# EAGLE design MainBoard (EAGLE 7.7.0)
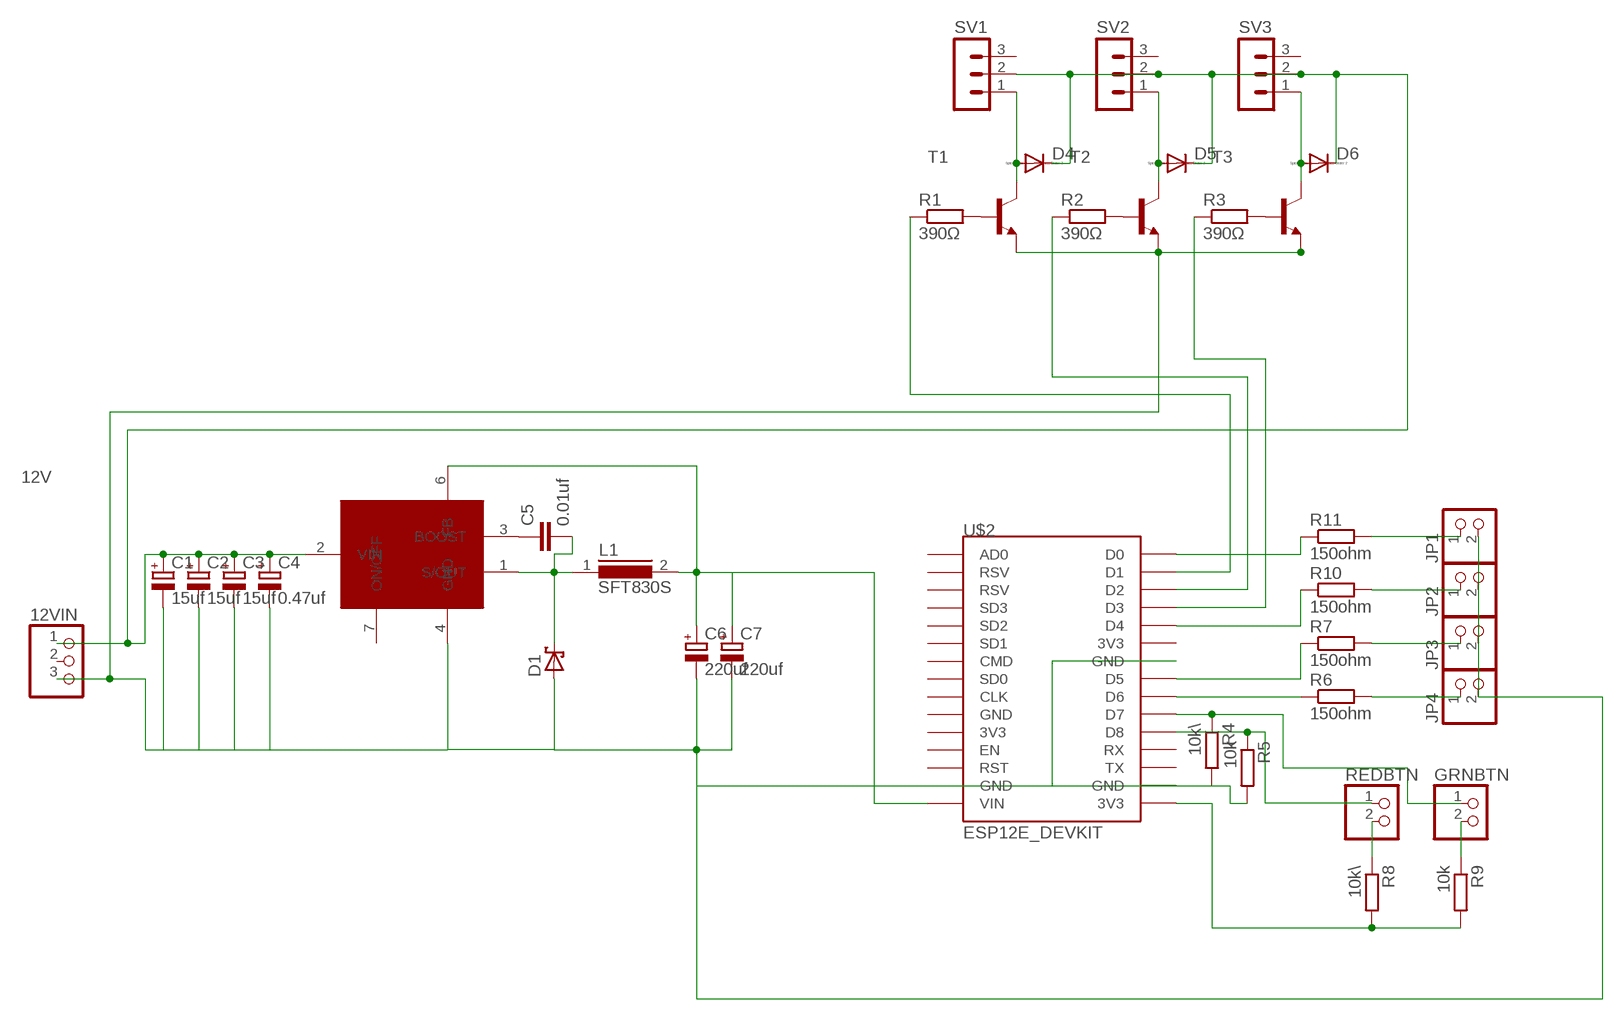
[diagram p0: schematic, sheet 1]

## Parts
12VIN  PINHD-1X3  [1X03]
C1  15uf  CPOL-EUE2,5-6E  [E2,5-6E]
C2  15uf  CPOL-EUE2,5-6E  [E2,5-6E]
C3  15uf  CPOL-EUE2,5-6E  [E2,5-6E]
C4  0.47uf  CPOL-EUE2,5-6E  [E2,5-6E]
C5  0.01uf  C-EU050-024X044  [C050-024X044]
C6  220uf  CPOL-EUE2,5-6E  [E2,5-6E]
C7  220uf  CPOL-EUE2,5-6E  [E2,5-6E]
D1  SCHOTTKY-DIODEC4111-15  [C4111-15]
D4  DIODE-D-2.5  [D-2.5]
D5  DIODE-D-2.5  [D-2.5]
D6  DIODE-D-2.5  [D-2.5]
GRNBTN  PINHD-1X2  [1X02]
JP1  PINHD-1X2  [1X02]
JP2  PINHD-1X2  [1X02]
JP3  PINHD-1X2  [1X02]
JP4  PINHD-1X2  [1X02]
L1  SFT830S  [SFT830S]
R1  390Ω  R-EU_0207/5V  [0207/5V]
R2  390Ω  R-EU_0207/5V  [0207/5V]
R3  390Ω  R-EU_0207/5V  [0207/5V]
R4  10k\  R-EU_0207/5V  [0207/5V]
R5  10k  R-EU_0207/5V  [0207/5V]
R6  150ohm  R-EU_0204/2V  [0204V]
R7  150ohm  R-EU_0204/2V  [0204V]
R8  10k\  R-EU_0207/5V  [0207/5V]
R9  10k  R-EU_0207/5V  [0207/5V]
R10  150ohm  R-EU_0204/2V  [0204V]
R11  150ohm  R-EU_0204/2V  [0204V]
REDBTN  PINHD-1X2  [1X02]
SV1  MA03-1  [MA03-1]
SV2  MA03-1  [MA03-1]
SV3  MA03-1  [MA03-1]
T1  -NPN-TO92  [TO92]
T2  -NPN-TO92  [TO92]
T3  -NPN-TO92  [TO92]
U$1  LM2678T-5  [TO-220]
U$2  ESP12E_DEVKIT  [ESP12E_DEVKIT]

## Nets
5V: C6.+ C7.+ L1.2 U$1.6(FB) U$2.VIN
12V: 12VIN.1 C1.+ C2.+ C3.+ C4.+ D4.C D5.C D6.C SV1.2 SV2.2 SV3.2 U$1.2(VIN)
GND: 12VIN.3 C1.- C2.- C3.- C4.- C6.- C7.- D1.A JP1.2 JP2.2 JP3.2 JP4.2 R4.2 R5.2 T1.1(E) T2.1(E) T3.1(E) U$1.4(GND) U$2.GND@1(GND) U$2.GND@2(GND) U$2.GND@3(GND)
N$1: R1.1 U$2.D1
N$2: R2.1 U$2.D2
N$3: D4.A SV1.1 T1.3(C)
N$4: C5.2 D1.C L1.1 U$1.1(S/OUT)
N$5: D5.A SV2.1 T2.3(C)
N$6: C5.1 U$1.3(BOOST)
N$7: D6.A SV3.1 T3.3(C)
N$8: R3.1 U$2.D3
N$9: R1.2 T1.2(B)
N$10: R2.2 T2.2(B)
N$11: R3.2 T3.2(B)
N$12: R8.2 R9.2 U$2.3V3@2(3V3)
N$13: R8.1 REDBTN.2
N$15: R11.1 U$2.D0
N$16: R10.1 U$2.D4
N$17: R7.1 U$2.D5
N$18: R6.1 U$2.D6
N$19: JP1.1 R11.2
N$20: JP2.1 R10.2
N$21: JP3.1 R7.2
N$22: GRNBTN.2 R9.1
N$23: R5.1 REDBTN.1 U$2.D8
N$24: GRNBTN.1 R4.1 U$2.D7
N$25: JP4.1 R6.2
Unconnected: 12VIN.2 SV1.3 SV2.3 SV3.3 U$1.7(ON/OFF) U$2.3V3@0(3V3) U$2.3V3@1(3V3) U$2.AD0 U$2.CLK U$2.CMD U$2.EN U$2.GND@0(GND) U$2.RST U$2.RSV@0(RSV) U$2.RSV@1(RSV) U$2.RX U$2.SD0 U$2.SD1 U$2.SD2 U$2.SD3 U$2.TX

## Library data of the parts
12VIN = pinhead:PINHD-1X3: PIN HEADER
C1-C4 C6 C7 = rcl:CPOL-EU: POLARIZED CAPACITOR, European symbol
C5 = rcl:C-EU: CAPACITOR, European symbol
D1 = diode:SCHOTTKY-DIODE: Schottky Diode
D4-D6 = diode:DIODE-: DIODE
GRNBTN JP1-JP4 REDBTN = pinhead:PINHD-1X2: PIN HEADER
L1 = inductors:SFT830S: INDUCTOR
R1-R5 R8 R9 = resistor:R-EU_: RESISTOR, European symbol
R6 R7 R10 R11 = rcl:R-EU_: RESISTOR, European symbol
SV1-SV3 = con-lstb:MA03-1: PIN HEADER; OC_FARNELL: unknown; OC_NEWARK: unknown
T1-T3 = transistor:*-NPN-: NPN Transistror BF959 corrected 2008.03.06
U$1 = FanThingParts:LM2678T-5
U$2 = ESP12E_DEVKIT:ESP12E_DEVKIT: ESP12E DEVKIT BOARD

## Board
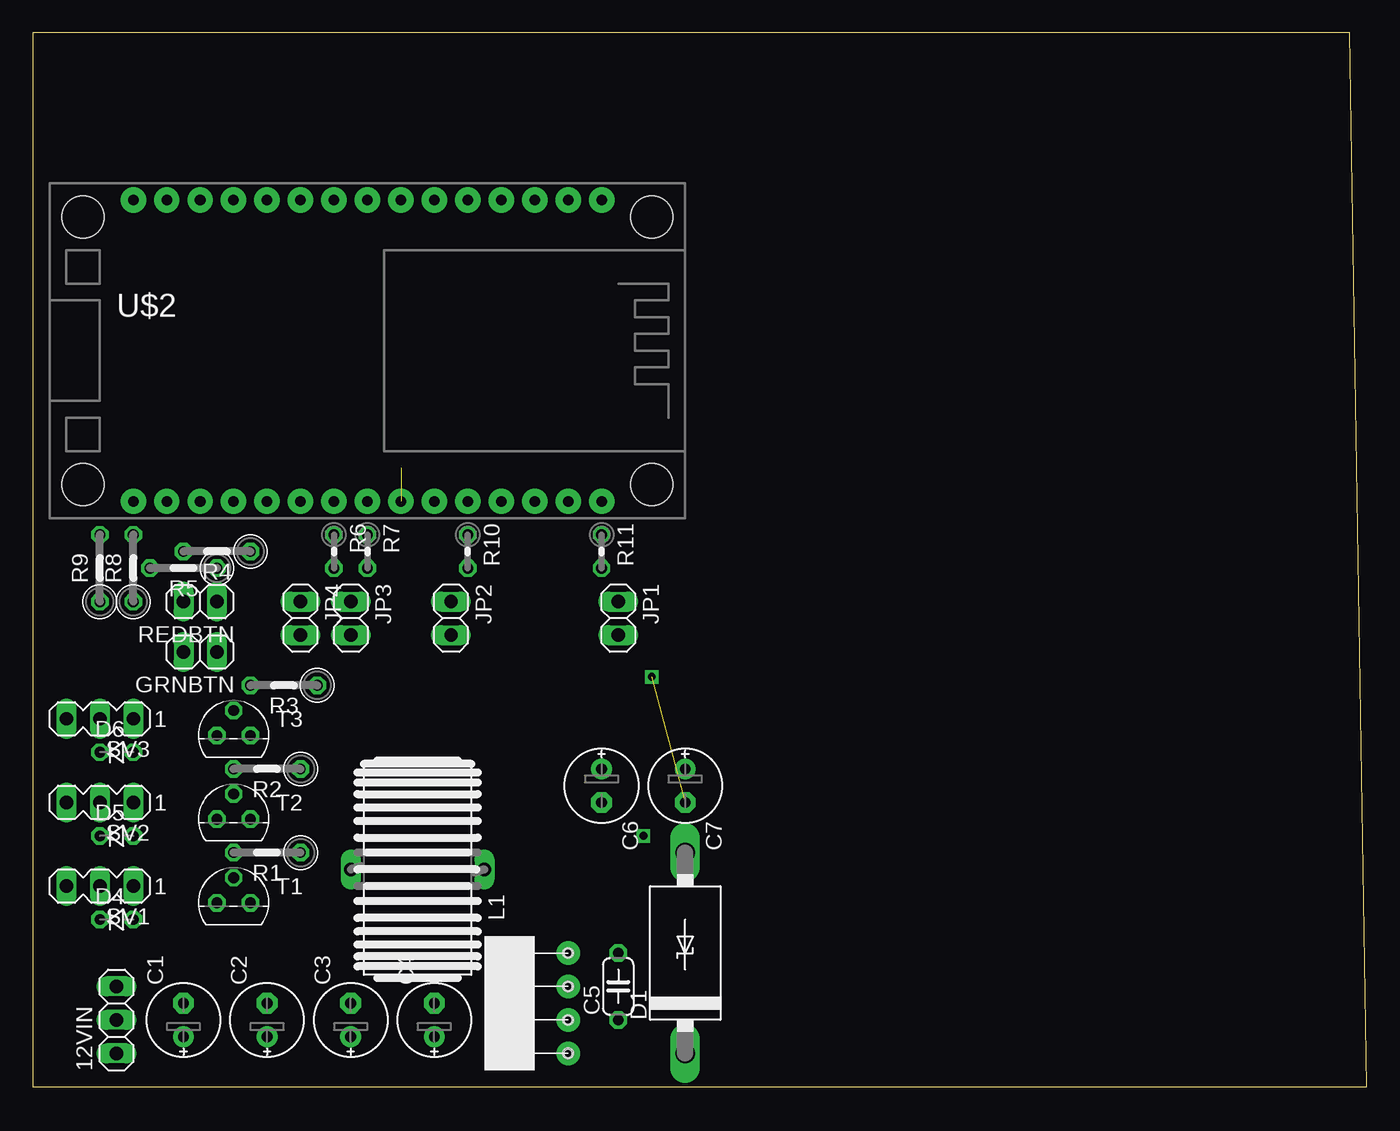
[diagram p1: board, top side]
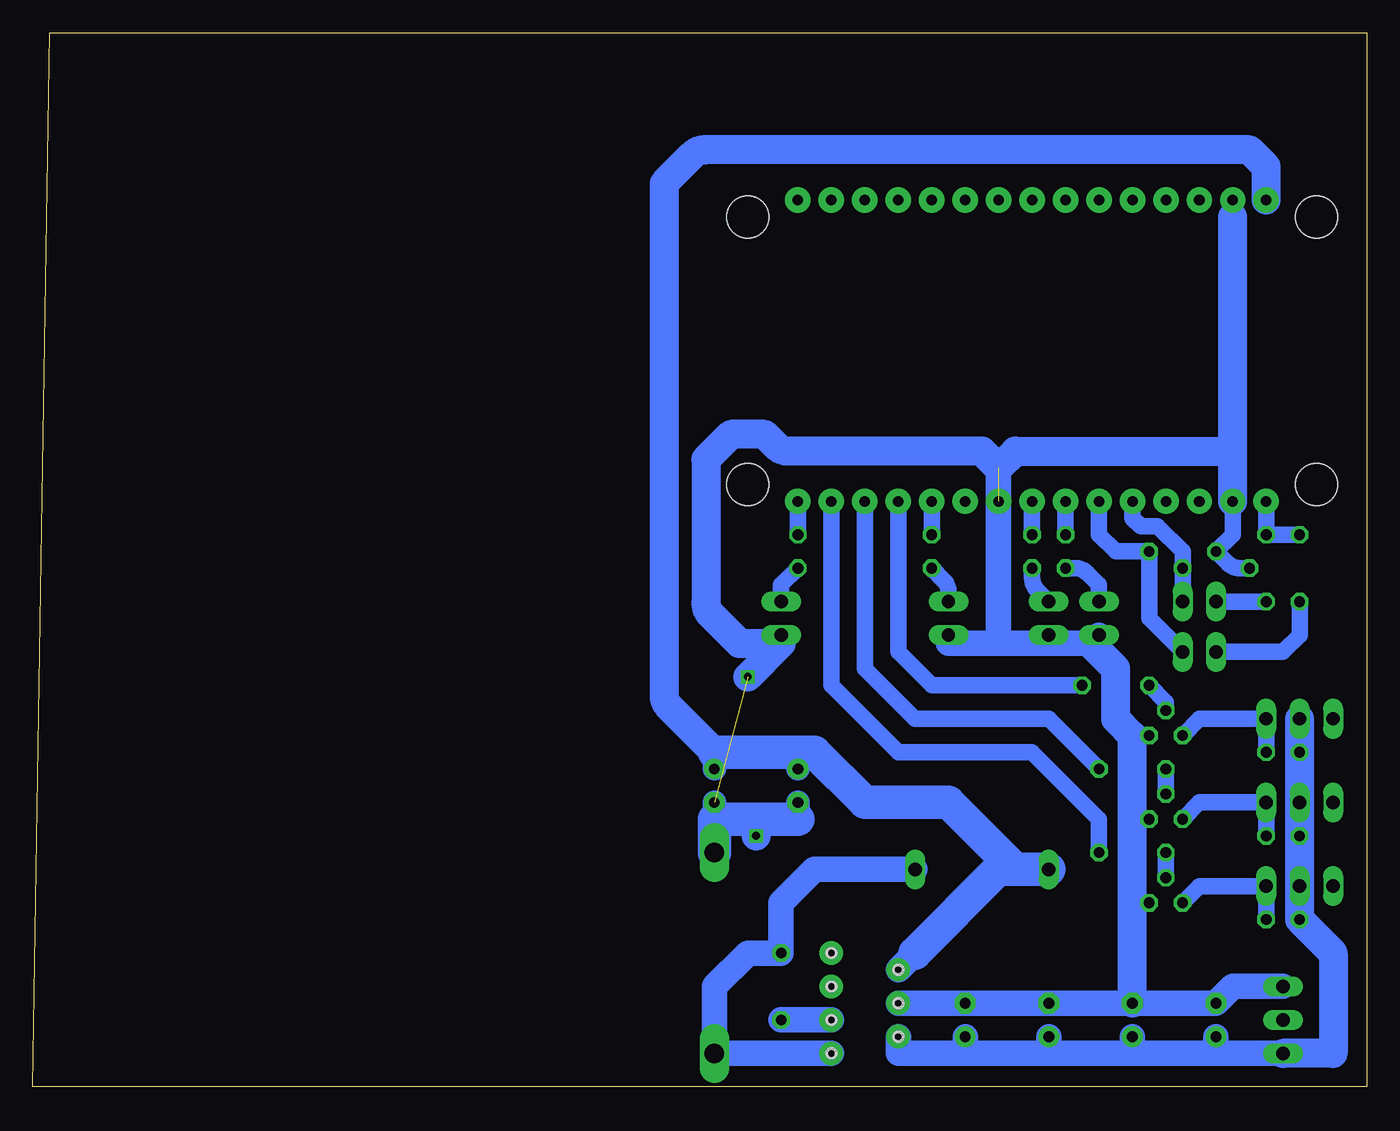
[diagram p2: board, bottom side, seen from below]

Size 101.27 x 80 mm. Coordinates in mm from the lower left corner, seen from the top.
Outline: 0,0 101.27,0 100,80 0,80 0,0
Copper layers (1*16): Top 0.035mm / dielectric 1.5mm / Bottom 0.035mm
Design rules "default": minimum track width 10mil, minimum drill 24mil, track to track 8mil, track to pad 8mil, pad to pad 8mil, via to via 8mil, smd to smd 8mil, copper to edge 40mil, drill to drill 8mil, minimum pad ring 10mil, minimum via ring 8mil, stop-mask expansion 4mil, vias tented up to drill 0mil, thermal gap 10mil

### Footprints (pad centres in the part's own frame; a part is rotated, then mirrored left to right if it is on the bottom)
1X03 = drill 1.016 long: 1 -2.54,0; 2 0,0; 3 2.54,0
E2,5-6E = drill 0.813 pad 1.575: + -1.27,0 | drill 0.813 pad 1.575 octagon: - 1.27,0
C050-024X044 = drill 0.813 octagon: 1 -2.54,0; 2 2.54,0
C4111-15 = drill 1.499 long: A 7.62,0; C -7.62,0
D-2.5 = drill 0.813 octagon: A 1.27,0; C -1.27,0
1X02 = drill 1.016 long: 1 -1.27,0; 2 1.27,0
SFT830S = drill 1.016 long: 1 -5.08,0; 2 5.08,0
0207/5V = drill 0.813 octagon: 1 -2.54,0; 2 2.54,0
0204V = drill 0.813 octagon: 1 -1.27,0; 2 1.27,0
MA03-1 = drill 1.016 long: 1 -2.54,0; 2 0,0; 3 2.54,0
TO92 = drill 0.813 octagon: 1 1.27,0; 2 0,1.905; 3 -1.27,0
TO-220 = drill 0.8 pad 1.778: 1 0,0; 2 -5.08,1.27; 3 0,2.54; 4 -5.08,3.81; 5 0,5.08; 6 -5.08,6.35; 7 0,7.62 | hole 0.6: 0,0; -5.08,1.27; 0,2.54; -5.08,3.81; 0,5.08; -5.08,6.35; 0,7.62 | hole 0.8: -5.08,1.27; 0,0; 0,2.54; -5.08,3.81; 0,5.08; -5.08,6.35; 0,7.62
ESP12E_DEVKIT = drill 0.8 pad 1.93: 3V3@0 -11.43,-7.62; 3V3@1 11.43,5.08; 3V3@2 11.43,-17.78; AD0 -11.43,17.78; CLK -11.43,-2.54; CMD -11.43,2.54; D0 11.43,17.78; D1 11.43,15.24; D2 11.43,12.7; D3 11.43,10.16; D4 11.43,7.62; D5 11.43,0; D6 11.43,-2.54; D7 11.43,-5.08; D8 11.43,-7.62; EN -11.43,-10.16; GND@0 -11.43,-5.08; GND@1 -11.43,-15.24; GND@2 11.43,2.54; GND@3 11.43,-15.24; RST -11.43,-12.7; RSV@0 -11.43,15.24; RSV@1 -11.43,12.7; RX 11.43,-10.16; SD0 -11.43,0; SD1 -11.43,5.08; SD2 -11.43,7.62; SD3 -11.43,10.16; TX 11.43,-12.7; VIN -11.43,-17.78 | hole 3.2: -10.16,21.59; 10.16,21.59; 10.16,-21.59; -10.16,-21.59

### Placement (x,y rotation side)
12VIN  6.35,5.08 90 top
C1  11.43,5.08 90 top
C2  17.78,5.08 90 top
C3  24.13,5.08 90 top
C4  30.48,5.08 90 top
C5  44.45,7.62 90 top
C6  43.18,22.86 270 top
C7  49.53,22.86 270 top
D1  49.53,10.16 90 top
D4  6.35,12.7 0 top
D5  6.35,19.05 0 top
D6  6.35,25.4 0 top
GRNBTN  12.7,33.02 180 top
JP1  44.45,35.56 270 top
JP2  31.75,35.56 270 top
JP3  24.13,35.56 270 top
JP4  20.32,35.56 270 top
L1  29.21,16.51 180 top
R1  17.78,17.78 180 top
R2  17.78,24.13 180 top
R3  19.05,30.48 180 top
R4  13.97,40.64 180 top
R5  11.43,39.37 180 top
R6  22.86,40.64 270 top
R7  25.4,40.64 270 top
R8  7.62,39.37 90 top
R9  5.08,39.37 90 top
R10  33.02,40.64 270 top
R11  43.18,40.64 270 top
REDBTN  12.7,36.83 180 top
SV1  5.08,15.24 180 top
SV2  5.08,21.59 180 top
SV3  5.08,27.94 180 top
T1  15.24,13.97 0 top
T2  15.24,20.32 0 top
T3  15.24,26.67 0 top
U$1  40.64,2.54 0 top
U$2  25.4,55.88 270 top

### Tracks (layer width: path | path; a pad name or v marks a point on that pad's centre or on a via)
5V
  Bottom 1.778: C6.+ 43.18,25.4 | C7.+ 49.53,25.4
  Bottom 1.93: U$1.6 34.29,10.16
  Bottom 2.184: U$2.VIN 7.62,69.85 8.89,71.12 50.27,71.12 arc-45 51.17,70.75 53.34,68.58 53.34,29.74 arc-45 52.97,28.84 49.53,25.4
  Bottom 2.54: 34.29,10.16 27.94,16.51 L1.2 26.67,16.51 31.75,21.59 38.1,21.59 41.91,25.4 43.18,25.4 49.53,25.4
12V
  Bottom 1.93: C1.+ 11.43,2.54 | C2.+ 17.78,2.54 | C3.+ 24.13,2.54 | C4.+ 30.48,2.54 | U$1.2 35.56,2.54 30.48,2.54 | 12VIN.1 11.43,2.54 | 11.43,2.54 17.78,2.54 | 17.78,2.54 24.13,2.54 | 24.13,2.54 30.48,2.54
  Bottom 2.184: 12VIN.1 2.54,2.54 2.54,10.16 D4.C SV1.2 D5.C SV2.2 D6.C SV3.2
GND  (via drill 0.6)  (2 unrouted)
  Bottom 1.27: T3.1 17.78,26.67 | T2.1 17.78,20.32 | T1.1 17.78,13.97 | JP2.2 31.75,33.66 | JP3.2 26.67,33.66 | R5.2 9.63,39.37 arc45 10.53,39.74 R4.2 10.16,41.91 U$2.GND@3 | U$2.GND@1 10.16,66.04 | JP1.2 44.45,33.66
  Bottom 1.778: C6.- 43.18,20.32 | C7.- 49.53,20.32
  Bottom 1.93: 12VIN.3 10.16,7.62 C1.- C2.- C3.- C4.- U$1.4 | 27.94,46.99 27.94,33.66 | 27.94,33.66 26.67,33.66 21.4,33.66 | 21.4,33.66 arc45 20.64,33.34 | 31.75,33.66 27.94,33.66 | 20.95,33.66 21.4,33.66 | JP4.2 20.32,33.55 arc-45 19.95,32.65 19.05,31.75
  Bottom 2.184: C2.- 17.78,13.97 17.78,20.32 17.78,26.67 19.05,27.94 19.05,31.75 20.64,33.34 20.95,33.66 | U$2.GND@3 10.16,48.26 | 10.16,48.26 10.16,66.04 | 10.16,48.26 26.67,48.26 27.94,46.99 29.21,48.26 43.92,48.26 arc45 44.82,48.63 45.72,49.53 48.26,49.53 50.16,47.62 50.16,36.72 arc-45 49.79,35.82 47.62,33.66 44.45,33.66 46.99,31.11 | v46.35,19.05 46.35,20.32
  Bottom 2.54: D1.A 49.53,20.32 46.35,20.32 43.18,20.32
N$1
  Bottom 1.27: R1.1 20.32,20.32 25.4,25.4 35.56,25.4 40.64,30.48 U$2.D1
N$2
  Bottom 1.27: U$2.D2 38.1,31.75 34.29,27.94 24.13,27.94 R2.1
N$3
  Bottom 1.27: D4.A SV1.1 12.7,15.24 T1.3
N$4
  Bottom 1.93: U$1.1 D1.C 49.53,7.62 46.99,10.16 C5.2 44.45,13.97 41.91,16.51 L1.1
N$5
  Bottom 1.27: D5.A SV2.1 12.7,21.59 T2.3
N$6
  Bottom 1.93: U$1.3 C5.1
N$7
  Bottom 1.27: D6.A SV3.1 12.7,27.94 T3.3
N$8
  Bottom 1.27: R3.1 33.02,30.48 35.56,33.02 U$2.D3
N$9
  Bottom 1.27: R1.2 T1.2
N$10
  Bottom 1.27: T2.2 R2.2
N$11
  Bottom 1.27: T3.2 15.24,29.21 R3.2
N$12
  Bottom 1.27: U$2.3V3@2 R8.2 R9.2
N$13
  Bottom 1.27: R8.1 REDBTN.2
N$15
  Bottom 1.27: R11.1 U$2.D0
N$16
  Bottom 1.27: R10.1 U$2.D4
N$17
  Bottom 1.27: U$2.D5 R7.1
N$18
  Bottom 1.27: U$2.D6 R6.1
N$19
  Bottom 1.27: R11.2 44.45,38.1 JP1.1
N$20
  Bottom 1.27: JP2.1 31.75,37.57 arc-45 32.12,38.47 R10.2
N$21
  Bottom 1.27: R7.2 25.4,38.63 arc-45 25.03,37.73 JP3.1
N$22
  Bottom 1.27: R9.1 5.08,34.29 6.35,33.02 GRNBTN.2
N$23
  Bottom 1.27: REDBTN.1 R5.1 13.97,40.64 15.88,42.55 17.14,42.55 17.78,43.18 U$2.D8
N$24
  Bottom 1.27: U$2.D7 20.32,41.91 19.05,40.64 R4.1 16.51,35.56 GRNBTN.1
N$25
  Bottom 1.27: R6.2 22.12,39.37 arc45 21.22,39 20.32,38.1 JP4.1
N$26  (via drill 0.6)
  other vias: 46.99,31.11